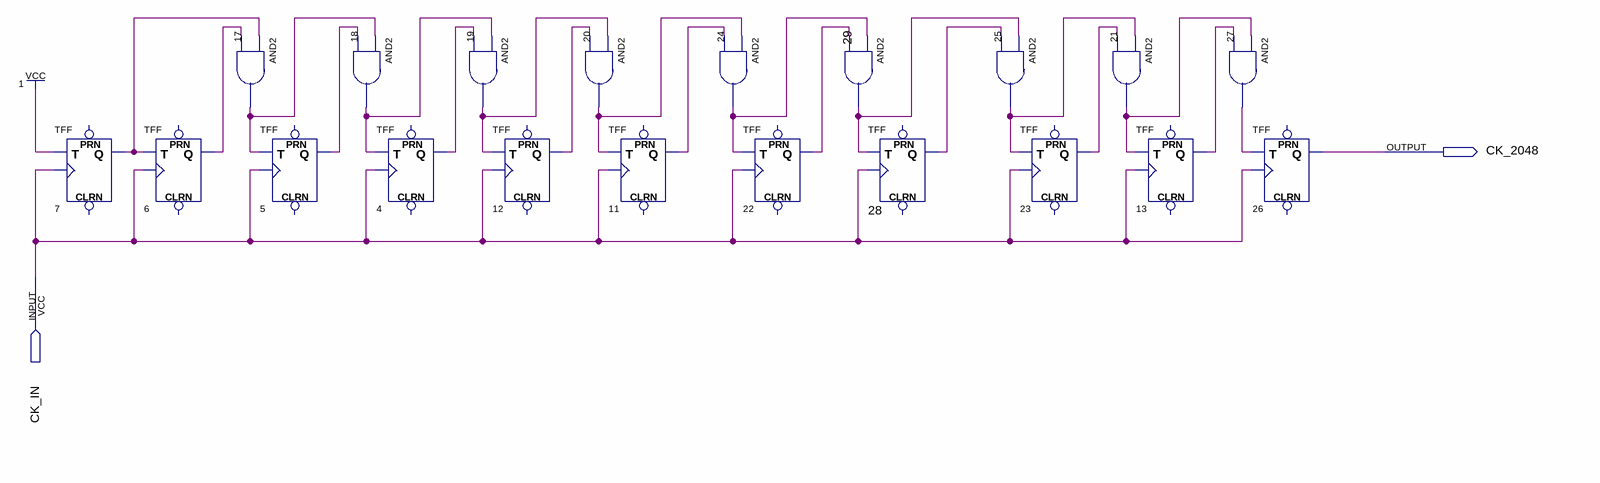
[diagram p0: schematic sheet]
// Quartus schematic div_2048.bdf as structural Verilog: 20 symbols, 2 pins
module div_2048 (
  input  CK_IN,
  output CK_2048
);

  wire n4_q, n5_q, n6_q, n7_q, n11_q, n12_q, n13_q, n17_out, n18_out, n19_out, n20_out, n21_out, n22_q,
       n23_q, n24_out, n25_out, n27_out, n28_q, n29_out;

  TFF u_7 (.T(1'b1), .CLK(CK_IN), .Q(n7_q));  // open: PRN, CLRN
  TFF u_6 (.T(n7_q), .CLK(CK_IN), .Q(n6_q));  // open: PRN, CLRN
  and u_17 (n17_out, n7_q, n6_q);
  TFF u_5 (.T(n17_out), .CLK(CK_IN), .Q(n5_q));  // open: PRN, CLRN
  and u_18 (n18_out, n17_out, n5_q);
  TFF u_4 (.T(n18_out), .CLK(CK_IN), .Q(n4_q));  // open: PRN, CLRN
  and u_19 (n19_out, n18_out, n4_q);
  TFF u_12 (.T(n19_out), .CLK(CK_IN), .Q(n12_q));  // open: PRN, CLRN
  and u_20 (n20_out, n19_out, n12_q);
  TFF u_11 (.T(n20_out), .CLK(CK_IN), .Q(n11_q));  // open: PRN, CLRN
  and u_24 (n24_out, n20_out, n11_q);
  TFF u_22 (.T(n24_out), .CLK(CK_IN), .Q(n22_q));  // open: PRN, CLRN
  and u_29 (n29_out, n24_out, n22_q);
  TFF u_28 (.T(n29_out), .CLK(CK_IN), .Q(n28_q));  // open: PRN, CLRN
  and u_25 (n25_out, n29_out, n28_q);
  TFF u_23 (.T(n25_out), .CLK(CK_IN), .Q(n23_q));  // open: PRN, CLRN
  and u_21 (n21_out, n25_out, n23_q);
  TFF u_13 (.T(n21_out), .CLK(CK_IN), .Q(n13_q));  // open: PRN, CLRN
  and u_27 (n27_out, n21_out, n13_q);
  TFF u_26 (.T(n27_out), .CLK(CK_IN), .Q(CK_2048));  // open: PRN, CLRN
endmodule
